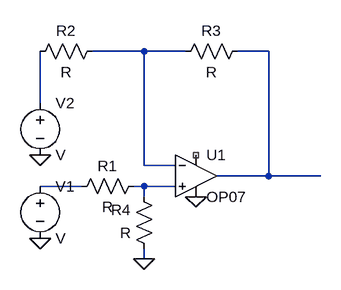
[diagram p0: schematic Differential.asc]
Differential.asc, the LTspice schematic file:
Version 4
SHEET 1 880 680
WIRE 192 288 112 288
WIRE 256 288 192 288
WIRE 384 288 336 288
WIRE 32 368 32 288
WIRE 192 464 192 288
WIRE 240 464 192 464
WIRE 384 480 384 288
WIRE 384 480 304 480
WIRE 464 480 384 480
WIRE 96 496 32 496
WIRE 192 496 176 496
WIRE 240 496 192 496
WIRE 192 512 192 496
WIRE 192 608 192 592
FLAG 192 608 0
FLAG 32 576 0
FLAG 32 448 0
FLAG 272 512 0
SYMBOL OpAmps\\OP07 272 416 R0
SYMATTR InstName U1
SYMBOL res 192 480 R90
WINDOW 0 0 56 VBottom 2
WINDOW 3 32 56 VTop 2
SYMATTR InstName R1
SYMBOL res 128 272 R90
WINDOW 0 0 56 VBottom 2
WINDOW 3 32 56 VTop 2
SYMATTR InstName R2
SYMBOL res 352 272 R90
WINDOW 0 0 56 VBottom 2
WINDOW 3 32 56 VTop 2
SYMATTR InstName R3
SYMBOL res 208 608 R180
WINDOW 0 36 76 Left 2
WINDOW 3 36 40 Left 2
SYMATTR InstName R4
SYMBOL voltage 32 480 R0
SYMATTR InstName V1
SYMBOL voltage 32 352 R0
SYMATTR InstName V2

The netlist it stands for:
* Differential.asc
XU1 N005 N001 NC_01 0 N002 LT1001  ; OP07, pins In+ In- V+ V- OUT
R1 N005 N004 R
R2 N001 N003 R
R3 N002 N001 R
R4 0 N005 R
V1 N004 0 V
V2 N003 0 V
.lib LTC.lib
.backanno
.end